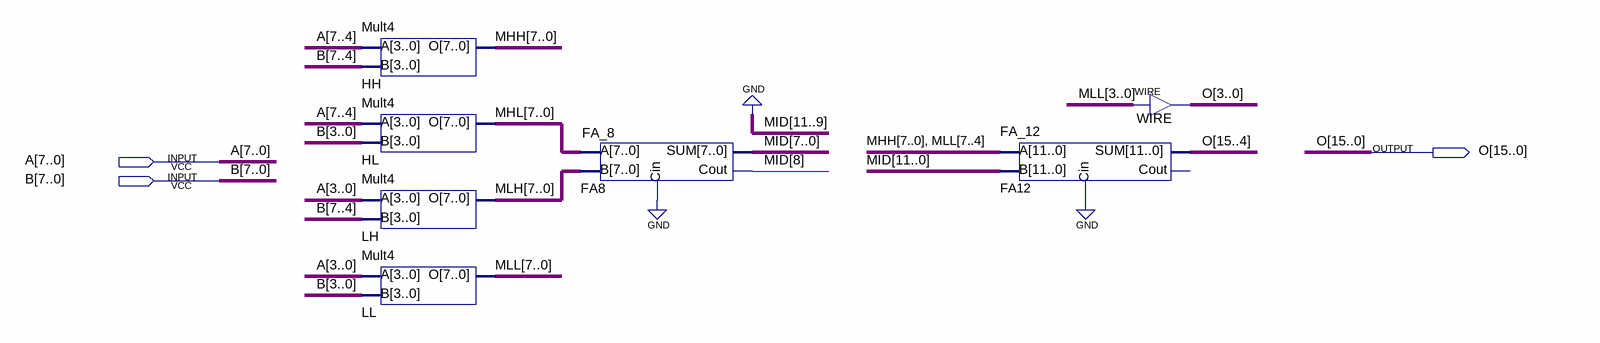
[diagram p0: schematic sheet]
// Quartus schematic Mult8.bdf as structural Verilog: 7 symbols, 3 pins
module Mult8 (
  input  [7:0] A,
  input  [7:0] B,
  output [15:0] O
);

  wire [7:0] MHH, MHL, MLH, MLL;
  wire [8:0] MID;

  Mult4 HH (.A(A[7:4]), .B(B[7:4]), .O(MHH));
  Mult4 HL (.A(A[7:4]), .B(B[3:0]), .O(MHL));
  Mult4 LH (.A(A[3:0]), .B(B[7:4]), .O(MLH));
  Mult4 LL (.A(A[3:0]), .B(B[3:0]), .O(MLL));
  FA_8 FA8 (.Cin(1'b0), .A(MHL), .B(MLH), .SUM(MID[7:0]), .Cout(MID[8]));
  FA_12 FA12 (.Cin(1'b0), .A({MHH, MLL[7:4]}), .B({3'b000, MID}), .SUM(O[15:4]));  // open: Cout
  assign O[3:0] = MLL[3:0];  // WIRE WIRE
endmodule
